# EAGLE schematic DigiStumpRGBSchematic (EAGLE 9.7.0)
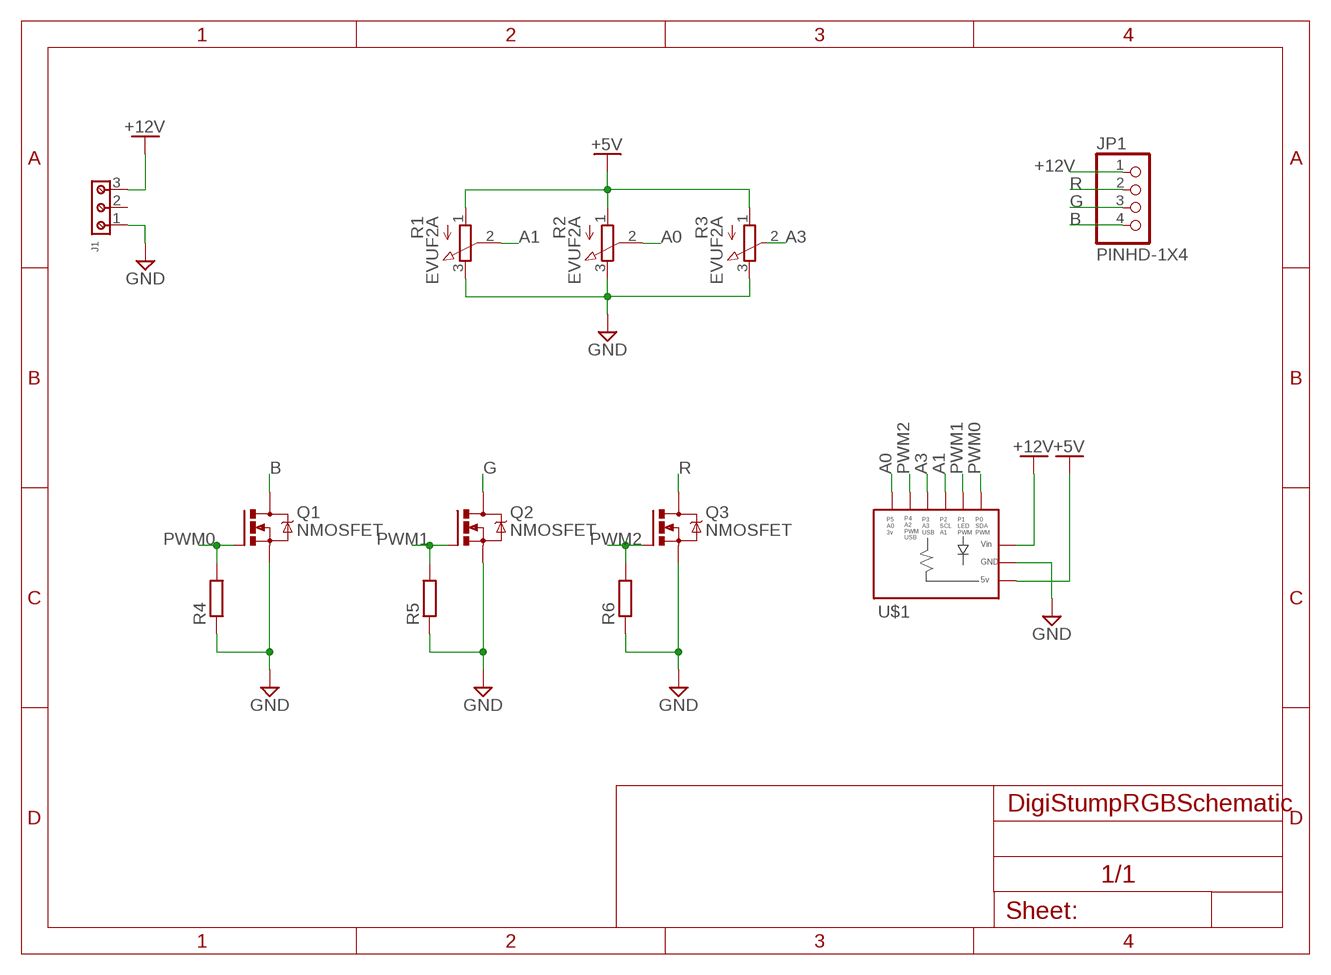
[diagram p0: schematic, sheet 1]

## Parts
J1  691101710003  [691101710003]
JP1  PINHD-1X4  [1X04]
Q1  NMOSFET  NMOSFET_TO92  [TO92-2.54MM]
Q2  NMOSFET  NMOSFET_TO92  [TO92-2.54MM]
Q3  NMOSFET  NMOSFET_TO92  [TO92-2.54MM]
R1  EVUF2A  [EVUF]
R2  EVUF2A  [EVUF]
R3  EVUF2A  [EVUF]
R4  RESISTORS0204V  [0204V]
R5  RESISTORS0204V  [0204V]
R6  RESISTORS0204V  [0204V]
U$1  DIGISPARK  [DIGISPARK]

## Nets
+5V [power]: R1.1(A) R2.1(A) R3.1(A) U$1.5V
+12V [power]: J1.3 JP1.1 U$1.VIN
A0: R2.2(S) U$1.P5
A1: R1.2(S) U$1.P2
A3: R3.2(S) U$1.P3
B [power]: JP1.4 Q1.1(D)
G [power]: JP1.3 Q2.1(D)
GND [power]: J1.1 Q1.3(S) Q2.3(S) Q3.3(S) R1.3(E) R2.3(E) R3.3(E) R4.1 R5.1 R6.1 U$1.GND
PWM0: Q1.2(G) R4.2 U$1.P0
PWM1: Q2.2(G) R5.2 U$1.P1
PWM2: Q3.2(G) R6.2 U$1.P4
R [power]: JP1.2 Q3.1(D)
Unconnected: J1.2

## Library data of the parts
J1 = Wurth_Connectors_WR-TBL Wire Protector:691101710003: WR-TBL Serie 101 - 5.00 mm Horiz. Entry Modular KIND PROPERTIES Pitch 5 mm MATERIAL PROPERTIES Insulator Material PA66 Insulator Flammability Rating UL94 V-0 Insulator Color Blue Contact Material Brass Contact Plating Copper over Zinc Terminal Screw Material Steel Terminal Screw Plating Zinc Wire Guard Material Stainless Steel GENERAL INFORMATION Operating Temperature -40 up to +105 °C Compliance Lead free / RoHS ELECTRICAL PROPERTIES IR UL 16 A IR VDE 16 A Working Voltage [UL] 250 V (AC) Working Voltage [VDE] 250 V (AC) Withstanding Voltage [UL] 1500 V (AC) Withstanding Voltage [cULus] 2000 V (AC) Withstanding Voltage [VDE] 2000 V (AC) Contact Resistance [UL] 20 mΩ Contact Resistance [cULus] 20 mΩ Contact Resistance [VDE] 20 mΩ MECHANICAL PROPERTIES Wire Strip Length 6 up to 7 (mm) Screw M3 Solid Wire Section (AWG) 26 to 14 (AWG) Solid Wire Section (Metric) 0.129 to 2.08 (mm²) Stranded Wire Section (AWG) 26 to 14 (AWG) Stranded Wire Section (Metric) 0.129 to 2.08 (mm²) CERTIFICATION UL Approval E315414 VDE Approval 40022614 PACKAGING PROPERTIES Packaging Box <https://katalog.we-online.com/media/images/v2/o33380v209%20Family_WR_TBL_691101710002.jpg> Details see: https://katalog.we-online.com/en/em/TBL_5_00_101_6911017100XX Updated by Ella Wu 2019-11-07 2019(C) Wurth Elektronik; DATASHEET-URL: https://www.we-online.com/catalog/datasheet/691101710003.pdf; IR-UL: 16A; IR-VDE: 16A; MOUNT: THT; PART-NUMBER: 691101710003; PINS: 3; PITCH: 5mm; TYPE: Horizontal; WIRE: 26 to 14 (AWG) 0.129 to 2.08 (mm²); WORKING-VOLTAGE-UL: 250V(AC); WORKING-VOLTAGE-VDE: 250V(AC)
JP1 = Connector:PINHD-1X4: PIN HEADER; CATEGORY: CONNECTOR; SUB-CATEGORY: PIN-HEADER
Q1-Q3 = MyLibrary:NMOSFET: N-Channel MOSFET - Generic; CATEGORY: Transistor; SUB-CATEGORY: MOSFET; TYPE: N-Channel
R1-R3 = pot:EVU: 9 mm Square Rotary Potentiometers Source: Panasonic
R4-R6 = MyLibrary:RESISTORS: RESISTOR, European symbol
U$1 = srg:DIGISPARK: Digispark http://digistump.com/wiki/digispark

## Net classes
1 power: width 1.016 mm